# EAGLE design amelia_A_v1 (EAGLE 9.6.2)
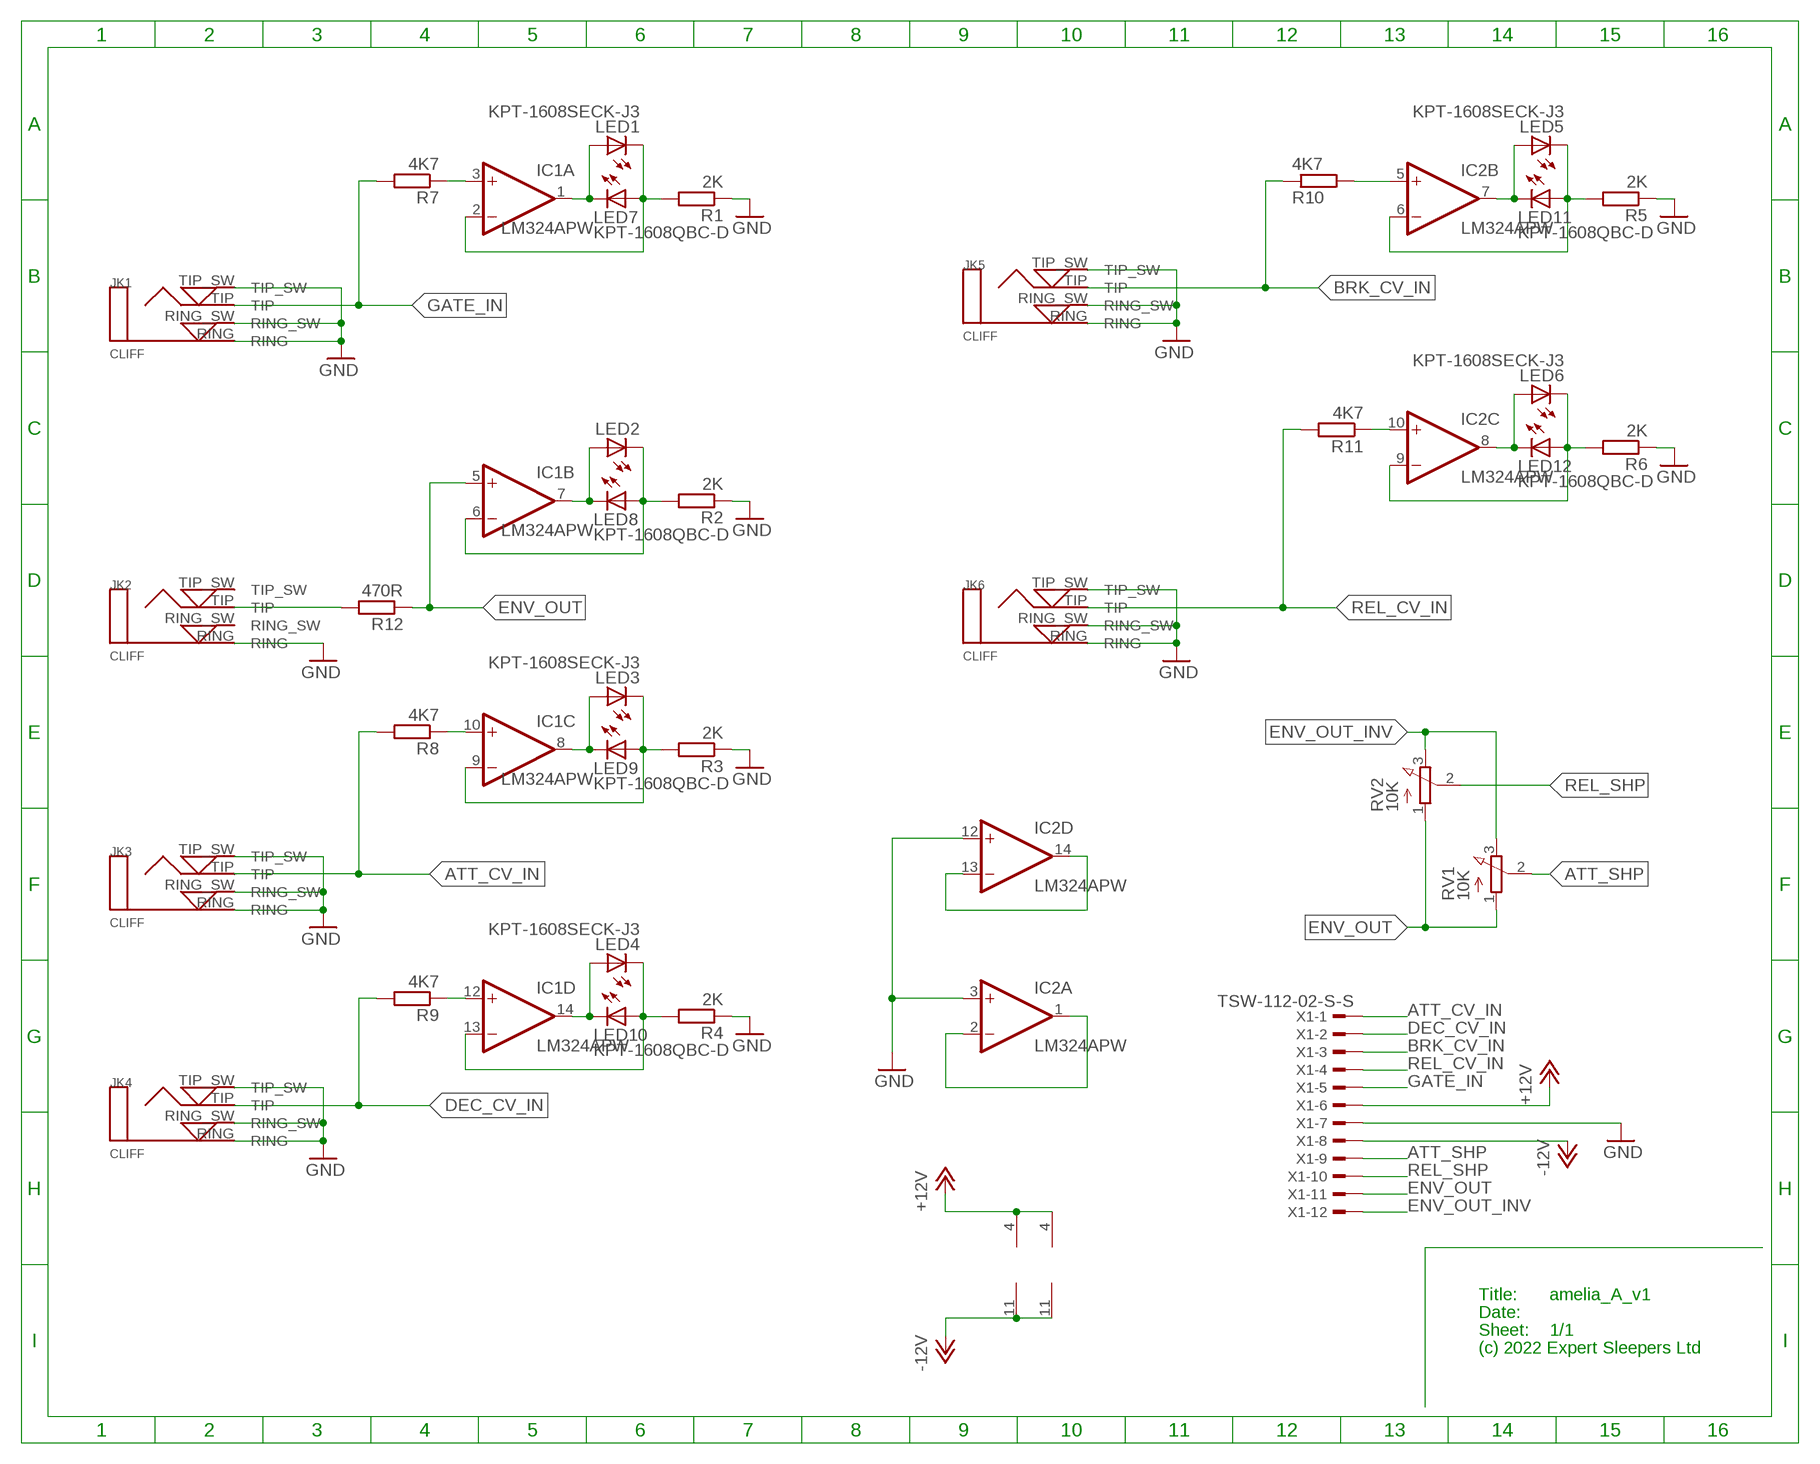
[diagram p0: schematic, sheet 1]

## Parts
IC1  LM324APW  TL074PW  [PW_R-PDSO-G14]
IC2  LM324APW  TL074PW  [PW_R-PDSO-G14]
JK1  CLIFF  CLIFF3.5MM_PCB_SW_JK  [CLIFF3.5MMPCB]
JK2  CLIFF  CLIFF3.5MM_PCB_SW_JK  [CLIFF3.5MMPCB]
JK3  CLIFF  CLIFF3.5MM_PCB_SW_JK  [CLIFF3.5MMPCB]
JK4  CLIFF  CLIFF3.5MM_PCB_SW_JK  [CLIFF3.5MMPCB]
JK5  CLIFF  CLIFF3.5MM_PCB_SW_JK  [CLIFF3.5MMPCB]
JK6  CLIFF  CLIFF3.5MM_PCB_SW_JK  [CLIFF3.5MMPCB]
LED1  KPT-1608SECK-J3  [CHIPLED_0603_LEFT]
LED2  KPT-1608SECK-J3  [CHIPLED_0603_LEFT]
LED3  KPT-1608SECK-J3  [CHIPLED_0603_LEFT]
LED4  KPT-1608SECK-J3  [CHIPLED_0603_LEFT]
LED5  KPT-1608SECK-J3  [CHIPLED_0603_LEFT]
LED6  KPT-1608SECK-J3  [CHIPLED_0603_LEFT]
LED7  KPT-1608QBC-D  [CHIPLED_0603_RIGHT]
LED8  KPT-1608QBC-D  [CHIPLED_0603_RIGHT]
LED9  KPT-1608QBC-D  [CHIPLED_0603_RIGHT]
LED10  KPT-1608QBC-D  [CHIPLED_0603_RIGHT]
LED11  KPT-1608QBC-D  [CHIPLED_0603_RIGHT]
LED12  KPT-1608QBC-D  [CHIPLED_0603_RIGHT]
R1  2K  R-EU_R1206  [R1206]
R2  2K  R-EU_R1206  [R1206]
R3  2K  R-EU_R1206  [R1206]
R4  2K  R-EU_R1206  [R1206]
R5  2K  R-EU_R1206  [R1206]
R6  2K  R-EU_R1206  [R1206]
R7  4K7  R-EU_R1206  [R1206]
R8  4K7  R-EU_R1206  [R1206]
R9  4K7  R-EU_R1206  [R1206]
R10  4K7  R-EU_R1206  [R1206]
R11  4K7  R-EU_R1206  [R1206]
R12  470R  R-EU_R1206  [R1206]
RV1  10K  RA0901NOX0A-VA1-131  [RA0901NOX0A-VA1-131]
RV2  10K  RA0901NOX0A-VA1-131  [RA0901NOX0A-VA1-131]
X1  TSW-112-02-S-S  [TSW-112-02-S-S]

## Nets
+12V: IC1.4(P:V+) IC2.4(P:V+) X1.6
-12V: IC1.11(P:V-) IC2.11(P:V-) X1.8
ATT_CV_IN: JK3.TIP R8.2 X1.1
ATT_SHP: RV1.2(S) X1.9
BRK_CV_IN: JK5.TIP R10.1 X1.3
DEC_CV_IN: JK4.TIP R9.2 X1.2
ENV_OUT: IC1.5(B:+IN) R12.1 RV1.1(A) RV2.1(A) X1.11
ENV_OUT_INV: RV1.3(E) RV2.3(E) X1.12
GATE_IN: JK1.TIP R7.2 X1.5
GND [power]: IC2.3(A:+IN) IC2.12(D:+IN) JK1.RING JK1.RING_SW JK1.TIP_SW JK2.RING JK3.RING JK3.RING_SW JK3.TIP_SW JK4.RING JK4.RING_SW JK4.TIP_SW JK5.RING JK5.RING_SW JK5.TIP_SW JK6.RING JK6.RING_SW JK6.TIP_SW R1.1 R2.1 R3.1 R4.1 R5.1 R6.1 X1.7
N$3: IC1.10(C:+IN) R8.1
N$4: IC1.13(D:-IN) LED4.1(C) LED10.1(A) R4.2
N$5: IC1.14(D:OUT) LED4.2(A) LED10.2(C)
N$6: IC2.1(A:OUT) IC2.2(A:-IN)
N$8: IC1.12(D:+IN) R9.1
N$11: IC1.8(C:OUT) LED3.2(A) LED9.2(C)
N$17: IC1.9(C:-IN) LED3.1(C) LED9.1(A) R3.2
N$19: IC1.1(A:OUT) LED1.2(A) LED7.2(C)
N$22: IC1.2(A:-IN) LED1.1(C) LED7.1(A) R1.2
N$25: IC1.3(A:+IN) R7.1
N$29: IC1.7(B:OUT) LED2.2(A) LED8.2(C)
N$30: IC1.6(B:-IN) LED2.1(C) LED8.1(A) R2.2
N$47: IC2.5(B:+IN) R10.2
N$65: IC2.8(C:OUT) LED6.2(A) LED12.2(C)
N$66: IC2.9(C:-IN) LED6.1(C) LED12.1(A) R6.2
N$71: IC2.7(B:OUT) LED5.2(A) LED11.2(C)
N$72: IC2.6(B:-IN) LED5.1(C) LED11.1(A) R5.2
N$76: IC2.10(C:+IN) R11.1
N$81: JK2.TIP R12.2
N$85: IC2.13(D:-IN) IC2.14(D:OUT)
REL_CV_IN: JK6.TIP R11.2 X1.4
REL_SHP: RV2.2(S) X1.10
Unconnected: JK2.RING_SW JK2.TIP_SW

## Notes on the sheet
- Title:
- Date:
- Sheet:
- (c) 2022 Expert Sleepers Ltd

## Library data of the parts
IC1 IC2 = digital-audio:TL074: OP AMP
JK1-JK6 = cliff:CLIFF3.5MM_PCB_SW_JK: Cliff 3.5mm Mono PCB switched jack socket
LED1-LED6 = kingbright:KPT-1608SECK-J3
LED7-LED12 = kingbright:KPT-1608QBC-D
R1-R12 = rcl:R-EU_: RESISTOR, European symbol
RV1 RV2 = pots:RA0901NOX0A-VA1-131
X1 = con-samtec:TSW-112-02-S-S: THROUGH-HOLE .025" SQ POST HEADER Source: Samtec TSW.pdf; OC_FARNELL: unknown; OC_NEWARK: unknown

## Net classes
0 default: width 0.203 mm

## Board
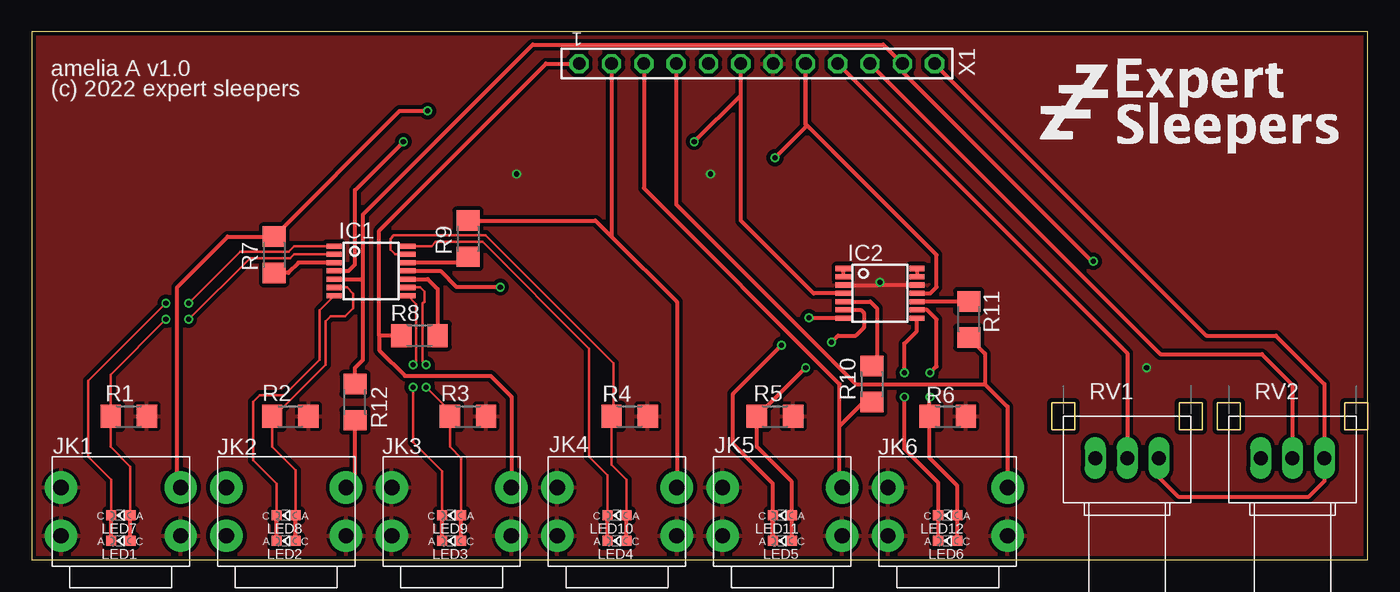
[diagram p1: board, top side]
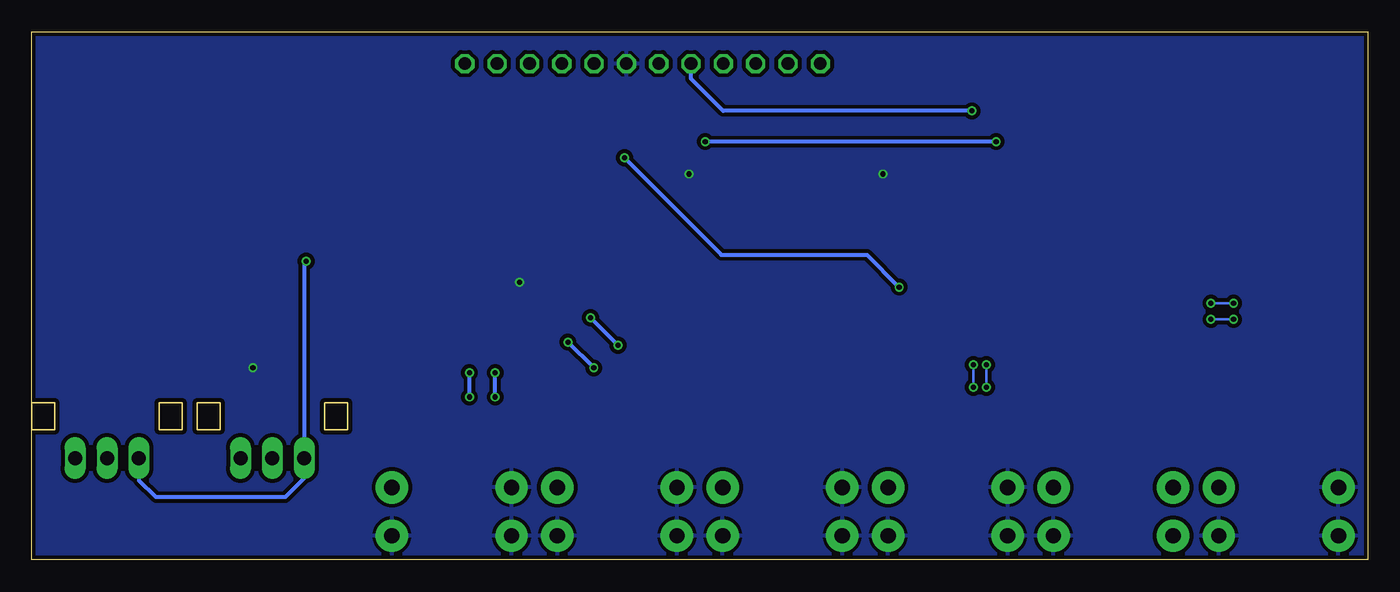
[diagram p2: board, bottom side, seen from below]

Size 105.01 x 41.5 mm. Coordinates in mm from the lower left corner, seen from the top.
Outline: 0,0 105.01,0 105.01,41.5 0,41.5 0,0
Copper layers (1*16): Top 0.035mm / dielectric 1.5mm / Bottom 0.035mm
Design rules "pcbtrain *": minimum track width 0.125mm, minimum drill 0.3mm, track to track 0.125mm, track to pad 0.125mm, pad to pad 0.125mm, via to via 0.125mm, smd to smd 0.125mm, copper to edge 0.25mm, drill to drill 8mil, minimum pad ring 0.15mm, minimum via ring 0.15mm, stop-mask expansion 4mil, vias tented up to drill 0mil, thermal gap 10mil

### Footprints (pad centres in the part's own frame; a part is rotated, then mirrored left to right if it is on the bottom)
PW_R-PDSO-G14 = smd 0.4 x 1.2: 1 -1.95,-2.9; 2 -1.3,-2.9; 3 -0.65,-2.9; 4 0,-2.9; 5 0.65,-2.9; 6 1.3,-2.9; 7 1.95,-2.9; 8 1.95,2.9; 9 1.3,2.9; 10 0.65,2.9; 11 0,2.9; 12 -0.65,2.9; 13 -1.3,2.9; 14 -1.95,2.9
CLIFF3.5MMPCB = drill 1.2 pad 2.54: RING 4.7,-1.9; RING_SW -4.7,-1.9; TIP 4.7,1.9; TIP_SW -4.7,1.9
CHIPLED_0603_LEFT = smd 0.8 x 0.8: 1 0,-0.75; 2 0,0.75
CHIPLED_0603_RIGHT = smd 0.8 x 0.8: 1 0,-0.75; 2 0,0.75
R1206 = smd 1.6 x 1.803: 1 -1.422,0; 2 1.422,0
RA0901NOX0A-VA1-131 = drill 1.1 long: 1 -2.5,3.5; 2 0,3.5; 3 2.5,3.5
TSW-112-02-S-S = drill 1 pad 1.5 octagon: 1 13.97,0; 2 11.43,0; 3 8.89,0; 4 6.35,0; 5 3.81,0; 6 1.27,0; 7 -1.27,0; 8 -3.81,0; 9 -6.35,0; 10 -8.89,0; 11 -11.43,0; 12 -13.97,0

### Placement (x,y rotation side)
IC1  26.67,22.71 270 top
IC2  66.67,20.95 270 top
JK1  7,3.8 0 top
JK2  20,3.8 0 top
JK3  33,3.8 0 top
JK4  46,3.8 0 top
JK5  59,3.8 0 top
JK6  72,3.8 0 top
LED1  7,1.5 90 top
LED2  20,1.5 90 top
LED3  33,1.5 90 top
LED4  46,1.5 90 top
LED5  59,1.5 90 top
LED6  72,1.5 90 top
LED7  7,3.5 90 top
LED8  20,3.5 90 top
LED9  33,3.5 90 top
LED10  46,3.5 90 top
LED11  59,3.5 90 top
LED12  72,3.5 90 top
R1  7.62,11.28 180 top
R2  20.32,11.28 180 top
R3  34.29,11.28 180 top
R4  46.99,11.28 180 top
R5  58.42,11.28 180 top
R6  72,11.28 180 top
R7  19.05,23.98 90 top
R8  30.48,17.63 180 top
R9  34.29,25.25 90 top
R10  66.04,13.82 90 top
R11  73.66,18.9 270 top
R12  25.4,12.4 270 top
RV1  86.1,4.5 0 top
RV2  99.1,4.5 0 top
U$1  [ES_ZZZ_TEXT_TPLACE_1IN_600DPI]  78.28,31.53 0 top
X1  57,39 180 top

### Tracks (layer width: path | path; a pad name or v marks a point on that pad's centre or on a via)
+12V  (via drill 0.4)
  Top 0.305: IC2.4 61.45,20.95 55.73,26.67 X1.6 55.73,36.53 v52.07,32.87 | IC1.4 24.89,22.71 25.4,23.22 25.4,29.06 v29.21,32.87
  Bottom 0.305: v29.21,32.87 v52.07,32.87
-12V  (via drill 0.4)
  Top 0.305: IC2.11 70.64,20.95 71.12,21.44 71.12,23.98 60.81,34.29 X1.8 60.81,33.99 v58.42,31.6 | IC1.11 32.13,22.71 33.4,21.44 v36.83,21.44
  Bottom 0.305: v36.83,21.44 39.37,23.98 50.8,23.98 v58.42,31.6
ATT_CV_IN
  Top 0.305: 27.3,17.63 27.3,25.89 40.42,39 X1.1 | R8.2 27.3,17.63 | 27.3,17.63 27.3,16.49 29.34,14.46 36.07,14.46 37.7,12.82 JK3.TIP
ATT_SHP
  Top 0.305: X1.9 86.1,16.25 RV1.2
BRK_CV_IN
  Top 0.305: X1.3 48.11,29.21 63.5,13.82 63.5,10.52 | JK5.TIP 63.5,5.9 63.5,10.52 | R10.1 65.38,12.4 63.5,10.52
DEC_CV_IN
  Top 0.305: JK4.TIP 50.7,20.27 45.57,25.4 | 45.57,25.4 44.3,26.67 R9.2 | X1.2 45.57,25.4
ENV_OUT  (via drill 0.4)
  Top 0.305: R12.1 25.4,15.09 26.04,15.72 26.04,22.07 | 26.04,22.07 26.04,27.16 39.37,40.49 66.94,40.49 X1.11 68.43,38.37 83.32,23.47 v83.44,23.47 | IC1.5 26.02,22.06 26.04,22.07
  Bottom 0.305: v83.44,23.47 83.6,23.31 RV1.1 83.6,6.42 85.09,4.93 95.25,4.93 96.6,6.28 RV2.1
ENV_OUT_INV
  Top 0.305: X1.12 92.34,17.63 97.79,17.63 101.6,13.82 RV2.3 101.6,6.2 100.33,4.93 90.17,4.93 88.6,6.5 RV1.3
GATE_IN  (via drill 0.4)
  Top 0.305: JK1.TIP 11.43,5.97 11.43,21.44 15.39,25.4 R7.2 28.93,35.28 v31.11,35.28
  Bottom 0.305: v31.11,35.28 50.67,35.28 53.19,37.8 X1.5
GND  (via drill 0.4)
  Top 0.305: IC2.3 66.46,21.61 v66.67,21.82 66.89,21.61 IC2.12
  other vias: 38.1,30.33 87.63,15.09 53.34,30.33
  pour Top (isolate 0.305): 0,0 105,0 105,41.5 0,41.5
  pour Bottom (isolate 0.305): 0,0 105,0 105,41.5 0,41.5
N$3
  Top 0.305: IC1.10 31.13,22.06 31.9,21.29 R8.1
N$4
  Top 0.203: IC1.13 28.55,24.01 28.19,24.36 28.19,25.25 28.45,25.5 35.69,25.5 45.72,15.47 45.72,11.43 R4.2 45.57,7.5 46.75,6.31 LED10.1
  Top 0.305: LED4.1 LED10.1
N$5
  Top 0.203: LED10.2 45.25,6.67 43.81,8.11 43.81,16.61 35.43,25 31.75,25 31.41,24.66 IC1.14
  Top 0.305: LED4.2 LED10.2
N$6
  Top 0.305: IC2.1 IC2.2
N$8
  Top 0.305: R9.1 33.82,23.36 IC1.12
N$11  (via drill 0.4)
  Top 0.203: IC1.8 30.23,20.1 30.23,15.6 v29.97,15.34 | v29.97,13.57 29.97,9.25 32.25,6.97 LED9.2
  Top 0.305: LED3.2 LED9.2
  Bottom 0.203: v29.97,15.34 v29.97,13.57
N$17  (via drill 0.4)
  Top 0.203: IC1.9 30.51,21.41 30.86,21.06 30.86,20.3 30.73,20.17 30.73,15.6 v30.99,15.34 | v30.99,13.57 32.87,11.69 R3.2 32.87,8.89 33.75,8.01 LED9.1
  Top 0.305: LED3.1 LED9.1
  Bottom 0.203: v30.99,15.34 v30.99,13.57
N$19  (via drill 0.4)
  Top 0.203: IC1.1 20.62,24.66 20.19,24.23 16.38,24.23 v12.32,20.17 | v10.54,20.17 4.45,14.07 4.45,8.11 6.25,6.3 LED7.2
  Top 0.305: LED1.2 LED7.2
  Bottom 0.203: v12.32,20.17 v10.54,20.17
N$22  (via drill 0.4)
  Top 0.203: IC1.2 20.6,24.01 20.32,23.73 17.14,23.73 v12.32,18.9 | v10.54,18.9 6.2,14.56 R1.2 6.2,8.89 7.75,7.34 LED7.1
  Top 0.305: LED1.1 LED7.1
  Bottom 0.203: v12.32,18.9 v10.54,18.9
N$25
  Top 0.305: IC1.3 20.97,23.36 20.17,22.56 R7.1
N$29
  Top 0.203: LED8.2 19.25,6 17.4,7.85 17.4,12.42 17.91,12.93 19.85,12.93 22.64,15.72 22.64,19.63 IC1.7
  Top 0.305: LED2.2 LED8.2
N$30
  Top 0.203: IC1.6 24.8,21.41 25.27,20.93 25.27,19.79 24.64,19.15 23.5,19.15 23.11,18.77 23.11,15.34 19.05,11.28 R2.2 18.9,8.89 20.75,7.04 LED8.1
  Top 0.305: LED2.1 LED8.1
N$47
  Top 0.305: IC2.5 65.91,20.3 66.42,19.79 66.42,15.62 R10.2
N$65  (via drill 0.4)
  Top 0.305: LED6.2 LED12.2 71.25,6.07 68.58,8.74 v68.58,12.8 | v68.58,14.71 68.58,17 69.58,17.99 IC2.8
  Bottom 0.305: v68.58,12.8 v68.58,14.71
N$66  (via drill 0.4)
  Top 0.305: LED6.1 LED12.1 72.75,5.84 70.58,8.01 R6.2 70.58,12.77 v70.61,12.8 | v70.61,14.71 71.12,15.22 71.12,18.9 70.36,19.66 IC2.9
  Bottom 0.305: v70.61,12.8 v70.61,14.71
N$71  (via drill 0.4)
  Top 0.305: LED11.2 58.25,5.99 55.12,9.12 55.12,13.06 v58.93,16.87 | v61.09,19.03 63.75,19.03 IC2.7
  Top 0.406: LED5.2 LED11.2
  Bottom 0.305: v58.93,16.87 v61.09,19.03
N$72  (via drill 0.4)
  Top 0.305: LED5.1 LED11.1 59.75,6.14 57,8.89 R5.2 60.81,15.09 v60.83,15.09 | v62.87,17.12 63.37,17.63 64.77,17.63 65.41,18.27 65.41,19.41 65.16,19.66 IC2.6
  Bottom 0.305: v60.83,15.09 v62.87,17.12
N$76
  Top 0.305: R11.1 73.64,20.3 IC2.10
N$81
  Top 0.305: JK2.TIP 25.4,6.4 R12.2
N$85
  Top 0.305: IC2.14 IC2.13
REL_CV_IN
  Top 0.305: X1.4 50.65,27.94 64.77,13.82 74.93,13.82 | 74.93,13.82 76.7,12.05 JK6.TIP | R11.2 74.93,16.21 74.93,13.82
REL_SHP
  Top 0.305: X1.10 88.72,16.18 96.7,16.18 99.1,13.78 RV2.2

### Text on the board
tPlace: amelia A v1.0 | (c) 2022 expert sleepers